# EasyEDA Pro project audio_interface_board.eprj

# Schematic Schematic1
Create Date: 2023-11-05; Page Name: P1; Project Name: audio_interface_board; Schematic Name: Schematic1; Update Date: 2023-11-24; Company: 嘉立创EDA; Page Size: A4; Version: V1.0
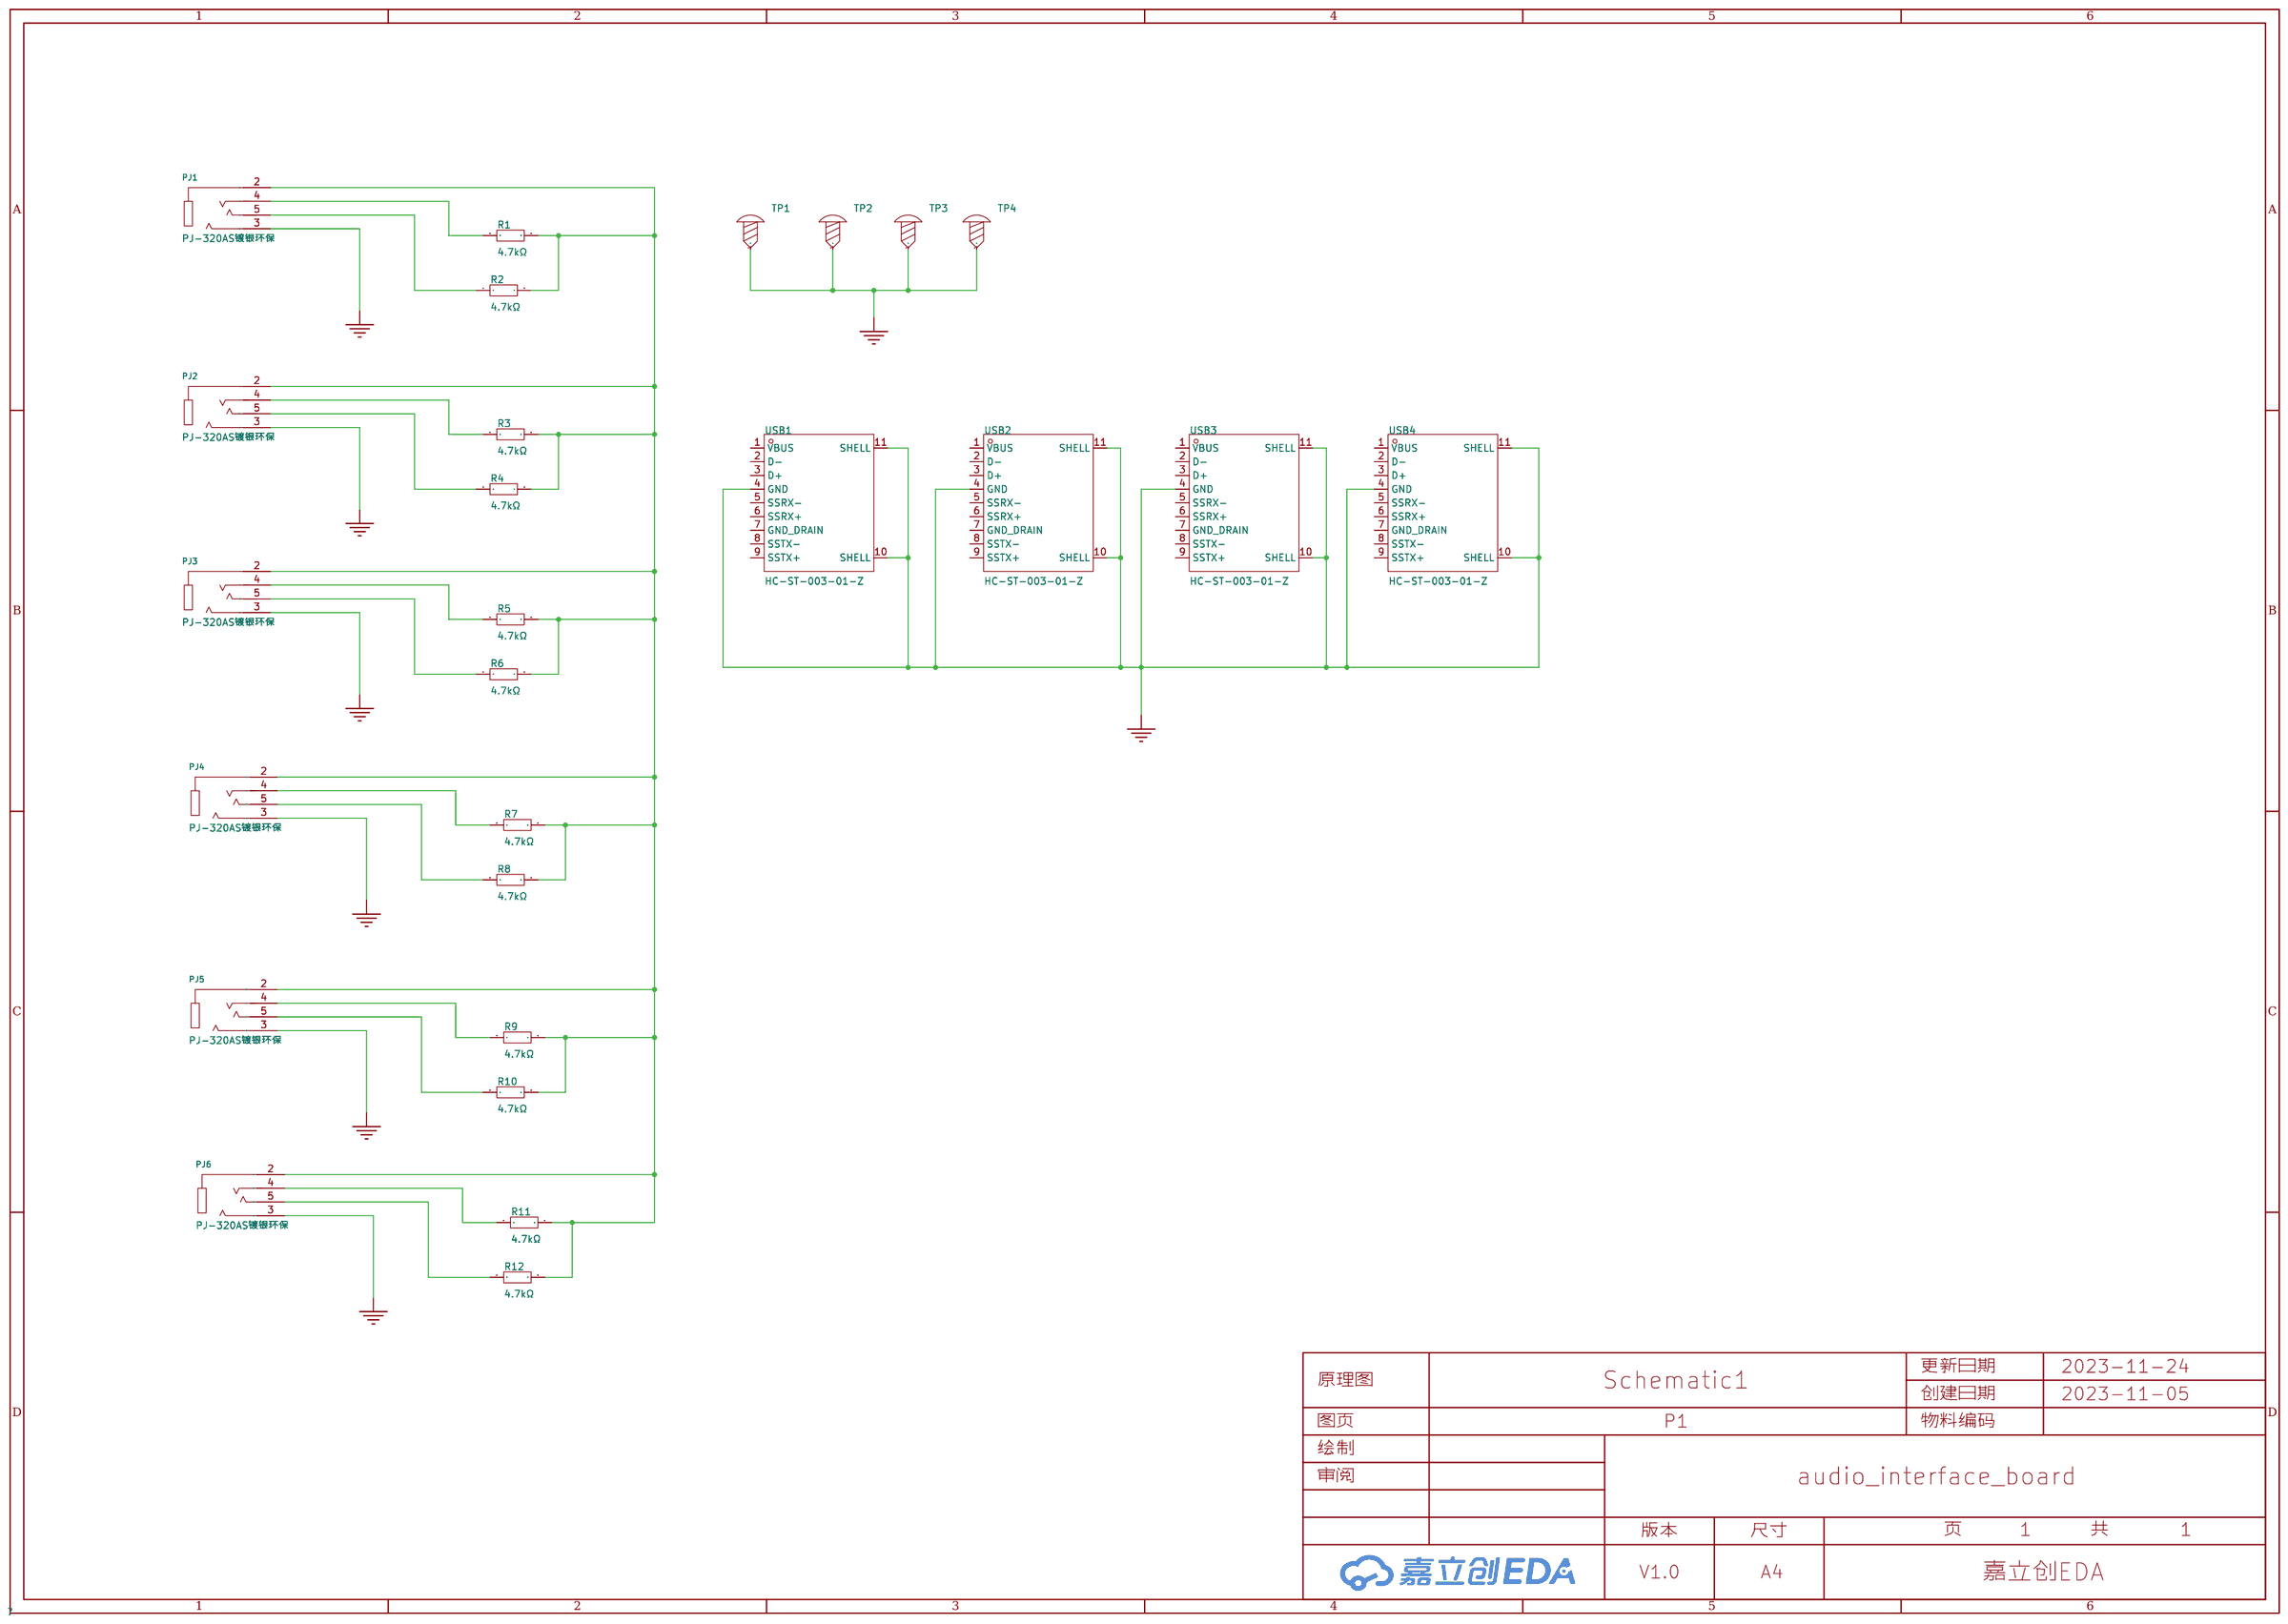
[diagram p0: schematic sheet]

## Parts
PJ1  PJ-320AS镀银环保  [AUDIO-TH_HAOYU_PJ-320AS]
PJ2  PJ-320AS镀银环保  [AUDIO-TH_HAOYU_PJ-320AS]
PJ3  PJ-320AS镀银环保  [AUDIO-TH_HAOYU_PJ-320AS]
PJ4  PJ-320AS镀银环保  [AUDIO-TH_HAOYU_PJ-320AS]
PJ5  PJ-320AS镀银环保  [AUDIO-TH_HAOYU_PJ-320AS]
PJ6  PJ-320AS镀银环保  [AUDIO-TH_HAOYU_PJ-320AS]
R1  4.7kΩ  [Res_1/8W]
R2  4.7kΩ  [Res_1/8W]
R3  4.7kΩ  [Res_1/8W]
R4  4.7kΩ  [Res_1/8W]
R5  4.7kΩ  [Res_1/8W]
R6  4.7kΩ  [Res_1/8W]
R7  4.7kΩ  [Res_1/8W]
R8  4.7kΩ  [Res_1/8W]
R9  4.7kΩ  [Res_1/8W]
R10  4.7kΩ  [Res_1/8W]
R11  4.7kΩ  [Res_1/8W]
R12  4.7kΩ  [Res_1/8W]
TP1  -  [M3螺丝]
TP2  -  [M3螺丝]
TP3  -  [M3螺丝]
TP4  -  [M3螺丝]
USB1  HC-ST-003-01-Z  [USB-3.0-A-TH_HC-ST-003-01-Z]
USB2  HC-ST-003-01-Z  [USB-3.0-A-TH_HC-ST-003-01-Z]
USB3  HC-ST-003-01-Z  [USB-3.0-A-TH_HC-ST-003-01-Z]
USB4  HC-ST-003-01-Z  [USB-3.0-A-TH_HC-ST-003-01-Z]

## Library data of the parts
PJ1-PJ6 = PJ-320AS镀银环保: 3.5mm耳机插座; LCSC Part Name: 3.5mm耳机插座; Supplier Part: C2939182; Manufacturer: HOOYA(皓宇电子); Supplier Footprint: 插件; JLCPCB Part Class: 扩展库; Datasheet: https://atta.szlcsc.com/upload/public/pdf/source/20220617/DBC4709FB9CB69A8BFEB2AD0F07AA409.pdf; Supplier: LCSC
R1-R12 = Res_AXIAL-1/8W: Supplier Footprint: 轴向引线
TP1-TP4 = M3螺丝: Supplier Footprint: 插件
USB1-USB4 = HC-ST-003-01-Z: 连接器类型:Type-A;标准:USB 3.0;公母:母座;触点数量:9;端口数量:1;安装方式:弯插;额定电流 - 电源:1.5A;工作温度范围:-25℃~+70℃;; LCSC Part Name: Type-A 母座 弯插; Supplier Part: C2845331; Manufacturer: HCTL(华灿天禄); Supplier Footprint: 插件; JLCPCB Part Class: 扩展库; Supplier: LCSC; Connector Type: Type-A; Standard: USB 3.0; Gender: 母座; Number of Contacts: 9; Number of Ports: 1; Mounting Style: 弯插; Current Rating - Power (Max): 1.5A; Operating Temperature Range: -25℃~+70℃

## Nets
GND: PJ1.3 PJ2.3 PJ3.3 PJ4.3 PJ5.3 PJ6.3 TP1.1 TP2.1 TP3.1 TP4.1 USB1.4(GND) USB1.10(SHELL) USB1.11(SHELL) USB2.4(GND) USB2.10(SHELL) USB2.11(SHELL) USB3.4(GND) USB3.10(SHELL) USB3.11(SHELL) USB4.4(GND) USB4.10(SHELL) USB4.11(SHELL)
$1N4684: PJ1.4 R1.1
$1N10647: PJ1.5 R2.1
$1N10980: PJ2.4 R3.1
$1N10991: PJ2.5 R4.1
$1N11095: PJ3.4 R5.1
$1N11106: PJ3.5 R6.1
$1N11210: PJ4.4 R7.1
$1N11221: PJ4.5 R8.1
$1N11325: PJ5.4 R9.1
$1N11336: PJ5.5 R10.1
$1N11440: PJ6.4 R11.1
$1N11451: PJ6.5 R12.1
$1N11754: PJ1.2 PJ2.2 PJ3.2 PJ4.2 PJ5.2 PJ6.2 R1.2 R2.2 R3.2 R4.2 R5.2 R6.2 R7.2 R8.2 R9.2 R10.2 R11.2 R12.2

Not connected (* = marked no-connect by the designer): USB1 1(VBUS) 2(D-) 3(D+) 5(SSRX-) 6(SSRX+) 7(GND_DRAIN) 8(SSTX-) 9(SSTX+); USB2 1(VBUS) 2(D-) 3(D+) 5(SSRX-) 6(SSRX+) 7(GND_DRAIN) 8(SSTX-) 9(SSTX+); USB3 1(VBUS) 2(D-) 3(D+) 5(SSRX-) 6(SSRX+) 7(GND_DRAIN) 8(SSTX-) 9(SSTX+); USB4 1(VBUS) 2(D-) 3(D+) 5(SSRX-) 6(SSRX+) 7(GND_DRAIN) 8(SSTX-) 9(SSTX+)

# Board PCB1
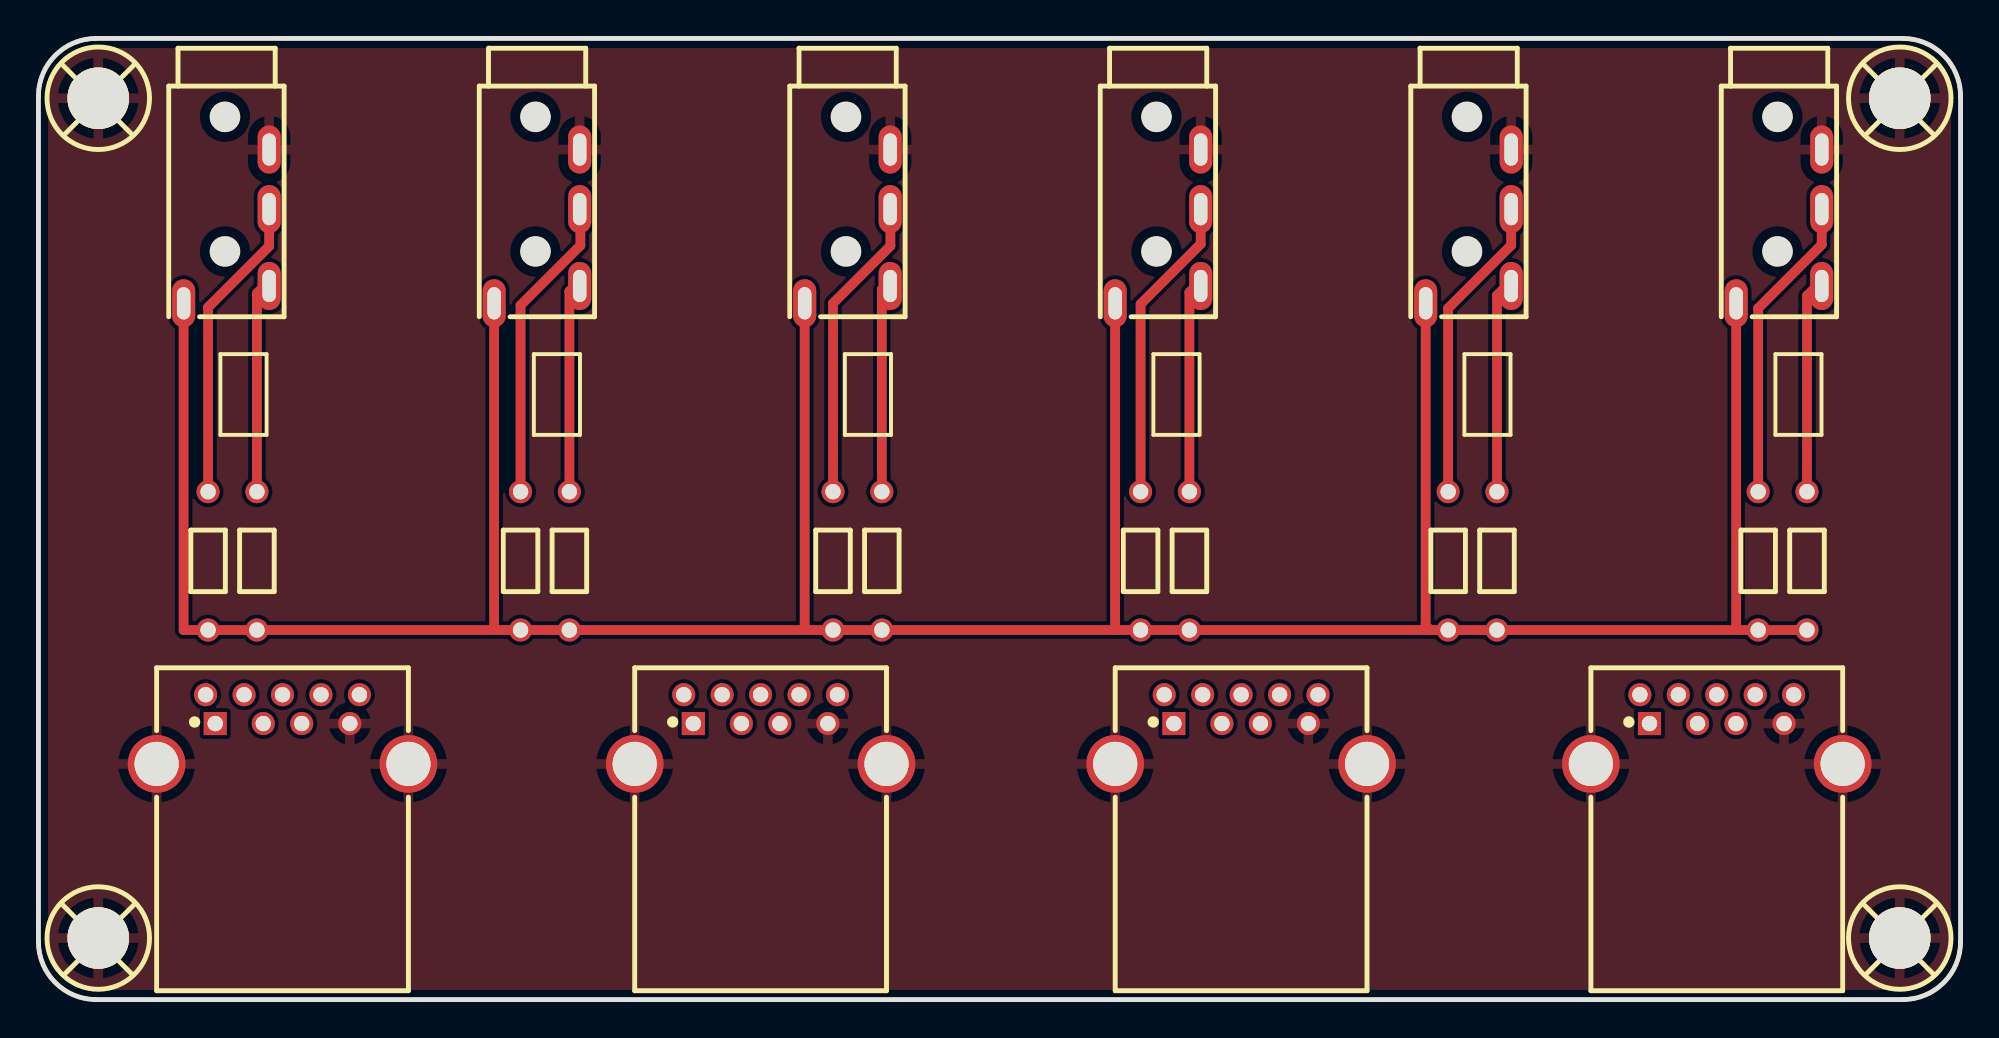
[diagram p1: board, top side]
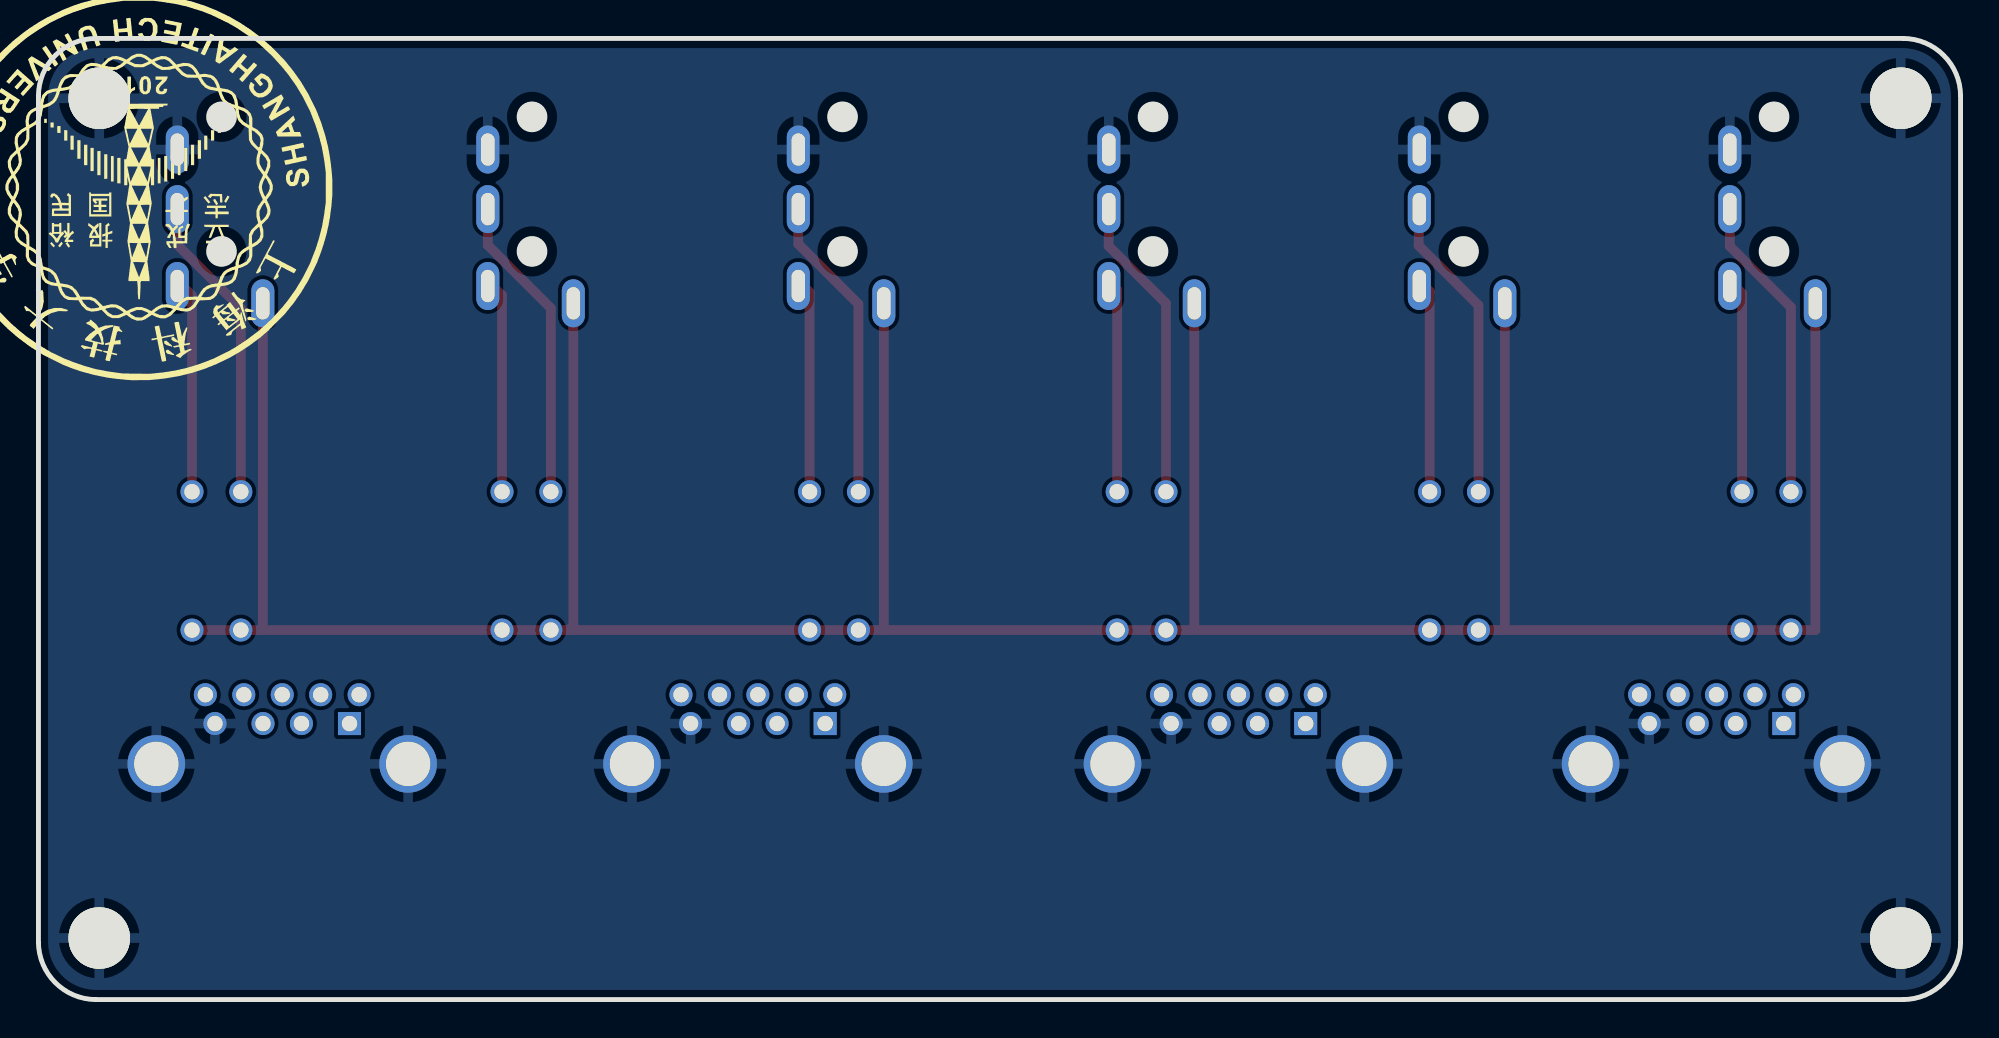
[diagram p2: board, bottom side, seen from below]

Outline 100 x 50 mm; copper layers: Top Layer, Bottom Layer. Coordinates in mm from the lower left corner of the outline.
Outline path: 0,47 0,3 arc(0.88,0.88) 3,0 97,0 arc(99.12,0.88) 100,3 100,47 arc(99.12,49.12) 97,50 3,50 arc(0.88,49.12) 0,47
Stack: Top Layer 0.035mm / Dielectric1 1.51mm FR4 er 4.5 / Bottom Layer 0.035mm

## Design rules (mm)
template: JLCPCB Capability(Two Layers Board)
spacing copperThickness1oz (default): track to track 0.102, other pairs 0.152 to 0.3
spacing copperThickness2oz: track to track 0.203, other pairs 0.152 to 0.3
track width copperThickness1oz (default): min 0.127, default 0.254, max 2.54
track width copperThickness2oz: min 0.203, default 0.254, max 2.54
differential pair differentialPair (default): width min 0.127, default 0.254, max 2.54; gap min 0.152, default 0.152
via viaSize (default): diameter min 0.5, default 0.61, max 10; hole min 0.3, default 0.305, max 6.3

## Placement (name value [footprint] x y rotation side)
PJ1  PJ-320AS镀银环保  [AUDIO-TH_HAOYU_PJ-320AS]  9.78 40.22 90 top
PJ2  PJ-320AS镀银环保  [AUDIO-TH_HAOYU_PJ-320AS]  25.93 40.22 90 top
PJ3  PJ-320AS镀银环保  [AUDIO-TH_HAOYU_PJ-320AS]  42.09 40.22 90 top
PJ4  PJ-320AS镀银环保  [AUDIO-TH_HAOYU_PJ-320AS]  58.24 40.22 90 top
PJ5  PJ-320AS镀银环保  [AUDIO-TH_HAOYU_PJ-320AS]  74.4 40.22 90 top
PJ6  PJ-320AS镀银环保  [AUDIO-TH_HAOYU_PJ-320AS]  90.55 40.22 90 top
R1  4.7kΩ  [Res_1/8W]  8.76 22.82 270 top
R2  4.7kΩ  [Res_1/8W]  11.3 22.82 270 top
R3  4.7kΩ  [Res_1/8W]  25.02 22.82 270 top
R4  4.7kΩ  [Res_1/8W]  27.56 22.82 270 top
R5  4.7kΩ  [Res_1/8W]  41.27 22.82 270 top
R6  4.7kΩ  [Res_1/8W]  43.82 22.82 270 top
R7  4.7kΩ  [Res_1/8W]  57.28 22.82 270 top
R8  4.7kΩ  [Res_1/8W]  59.82 22.82 270 top
R9  4.7kΩ  [Res_1/8W]  73.28 22.82 270 top
R10  4.7kΩ  [Res_1/8W]  75.82 22.82 270 top
R11  4.7kΩ  [Res_1/8W]  89.41 22.82 270 top
R12  4.7kΩ  [Res_1/8W]  91.95 22.82 270 top
TP1  -  [M3螺丝]  3.17 46.83 0 top
TP2  -  [M3螺丝]  96.9 46.83 0 top
TP3  -  [M3螺丝]  3.17 3.14 0 top
TP4  -  [M3螺丝]  96.9 3.14 0 top
USB1  HC-ST-003-01-Z  [USB-3.0-A-TH_HC-ST-003-01-Z]  12.7 14.06 0 top
USB2  HC-ST-003-01-Z  [USB-3.0-A-TH_HC-ST-003-01-Z]  37.57 14.06 0 top
USB3  HC-ST-003-01-Z  [USB-3.0-A-TH_HC-ST-003-01-Z]  62.57 14.06 0 top
USB4  HC-ST-003-01-Z  [USB-3.0-A-TH_HC-ST-003-01-Z]  87.32 14.06 0 top

## Footprints (pads in the part's own frame, mm; a bottom-side part is the same pattern mirrored in y, then rotated)
AUDIO-TH_HAOYU_PJ-320AS
  oval 2.5x1.2 hole 1.68x0.7: 2(-4,2.225) 3(4,-2.225) 4(0.9,-2.225) 5(-3.1,-2.225)
M3螺丝
  round 3.2 hole 3.2: 1(-0.064,0.064)
Res_1/8W
  round 1.199 hole 0.8: 1(-3.599,0.063) 2(3.599,0.063)
USB-3.0-A-TH_HC-ST-003-01-Z
  rect 1.2x1.2 hole 0.8: 1(-3.5,0.3)
  round 1.2 hole 0.8: 2(-1,0.3) 3(1,0.3) 4(3.5,0.3) 5(4,1.8) 6(2,1.8) 7(0,1.8) 8(-2,1.8) 9(-4,1.8)
  round 3 hole 2.3: 10(-6.55,-1.8) 11(6.55,-1.8)

## Nets
As in the schematic.

Pads without a net: USB1 1 2 3 5 6 7 8 9; USB2 1 2 3 5 6 7 8 9; USB3 1 2 3 5 6 7 8 9; USB4 1 2 3 5 6 7 8 9

## Routing (per net, layer and track width the routed paths; a pad name or vN(x,y) marks a point on that pad's centre or on a via; arc(x,y) is an arc through that point)
$1N4684: length 16.3
  Top Layer w0.508: R1.1 8.83,36.02 12,39.19 12,41.38
$1N10647: length 11.2
  Top Layer w0.508: R2.1 11.37,36.74 12,37.38
$1N10980: length 16.3
  Top Layer w0.508: 28.26,41.38 28.19,41.31 28.19,39.23 25.08,36.12 R3.1
$1N10991: length 11.2
  Top Layer w0.508: 28.16,37.38 27.62,36.84 R4.1
$1N11095: length 16.2
  Top Layer w0.508: 44.31,41.38 44.32,41.37 44.32,39.2 41.34,36.22 R5.1
$1N11106: length 11.1
  Top Layer w0.508: R6.1 43.88,36.94 44.31,37.38
$1N11210: length 16.2
  Top Layer w0.508: R7.1 57.34,36.18 60.47,39.31 60.47,41.38
$1N11221: length 11.2
  Top Layer w0.508: R8.1 59.88,36.79 60.47,37.38
$1N11325: length 16.3
  Top Layer w0.508: R9.1 73.34,35.97 76.62,39.25 76.62,41.38
$1N11336: length 11.3
  Top Layer w0.508: 76.62,37.38 75.88,36.64 R10.1
$1N11440: length 16.3
  Top Layer w0.508: 92.78,41.38 92.78,39.27 89.47,35.97 R11.1
$1N11451: length 11.3
  Top Layer w0.508: 92.78,37.38 92.01,36.61 R12.1
$1N11754: length 188.2
  Top Layer w0.508: 56.04,19.22 56.02,19.24 56.02,36.48 ; 56.04,19.22 R7.2 R8.2 72.41,19.22 ; 56.04,19.22 R6.2 R5.2 40.03,19.22 ; 88.33,19.22 R11.2 R12.2 ; 88.33,19.22 88.33,36.48 ; 88.33,19.22 R10.2 R9.2 72.41,19.22 ; 23.81,19.22 R3.2 R4.2 40.03,19.22 ; 23.81,19.22 R2.2 R1.2 7.55,19.22 7.55,36.48 ; 23.81,19.22 23.71,19.32 23.71,36.48 ; 39.86,36.48 39.86,19.39 40.03,19.22 ; 72.41,19.22 72.17,19.46 72.17,36.48

## Copper pours and planes (outline as drawn; the poured copper is in the pictures)
GND on Top Layer: 0,50 100.08,50 100.08,-0.04 0,-0.04
GND on Bottom Layer: 0,50 100.08,50 100.08,-0.04 0,-0.04

## Text on the board
Top Silkscreen Layer: ⑥ | ⑤ | ④ | ③ | ② | ①
